# EAGLE design batteryholder2S4P (EAGLE 9.5.0)
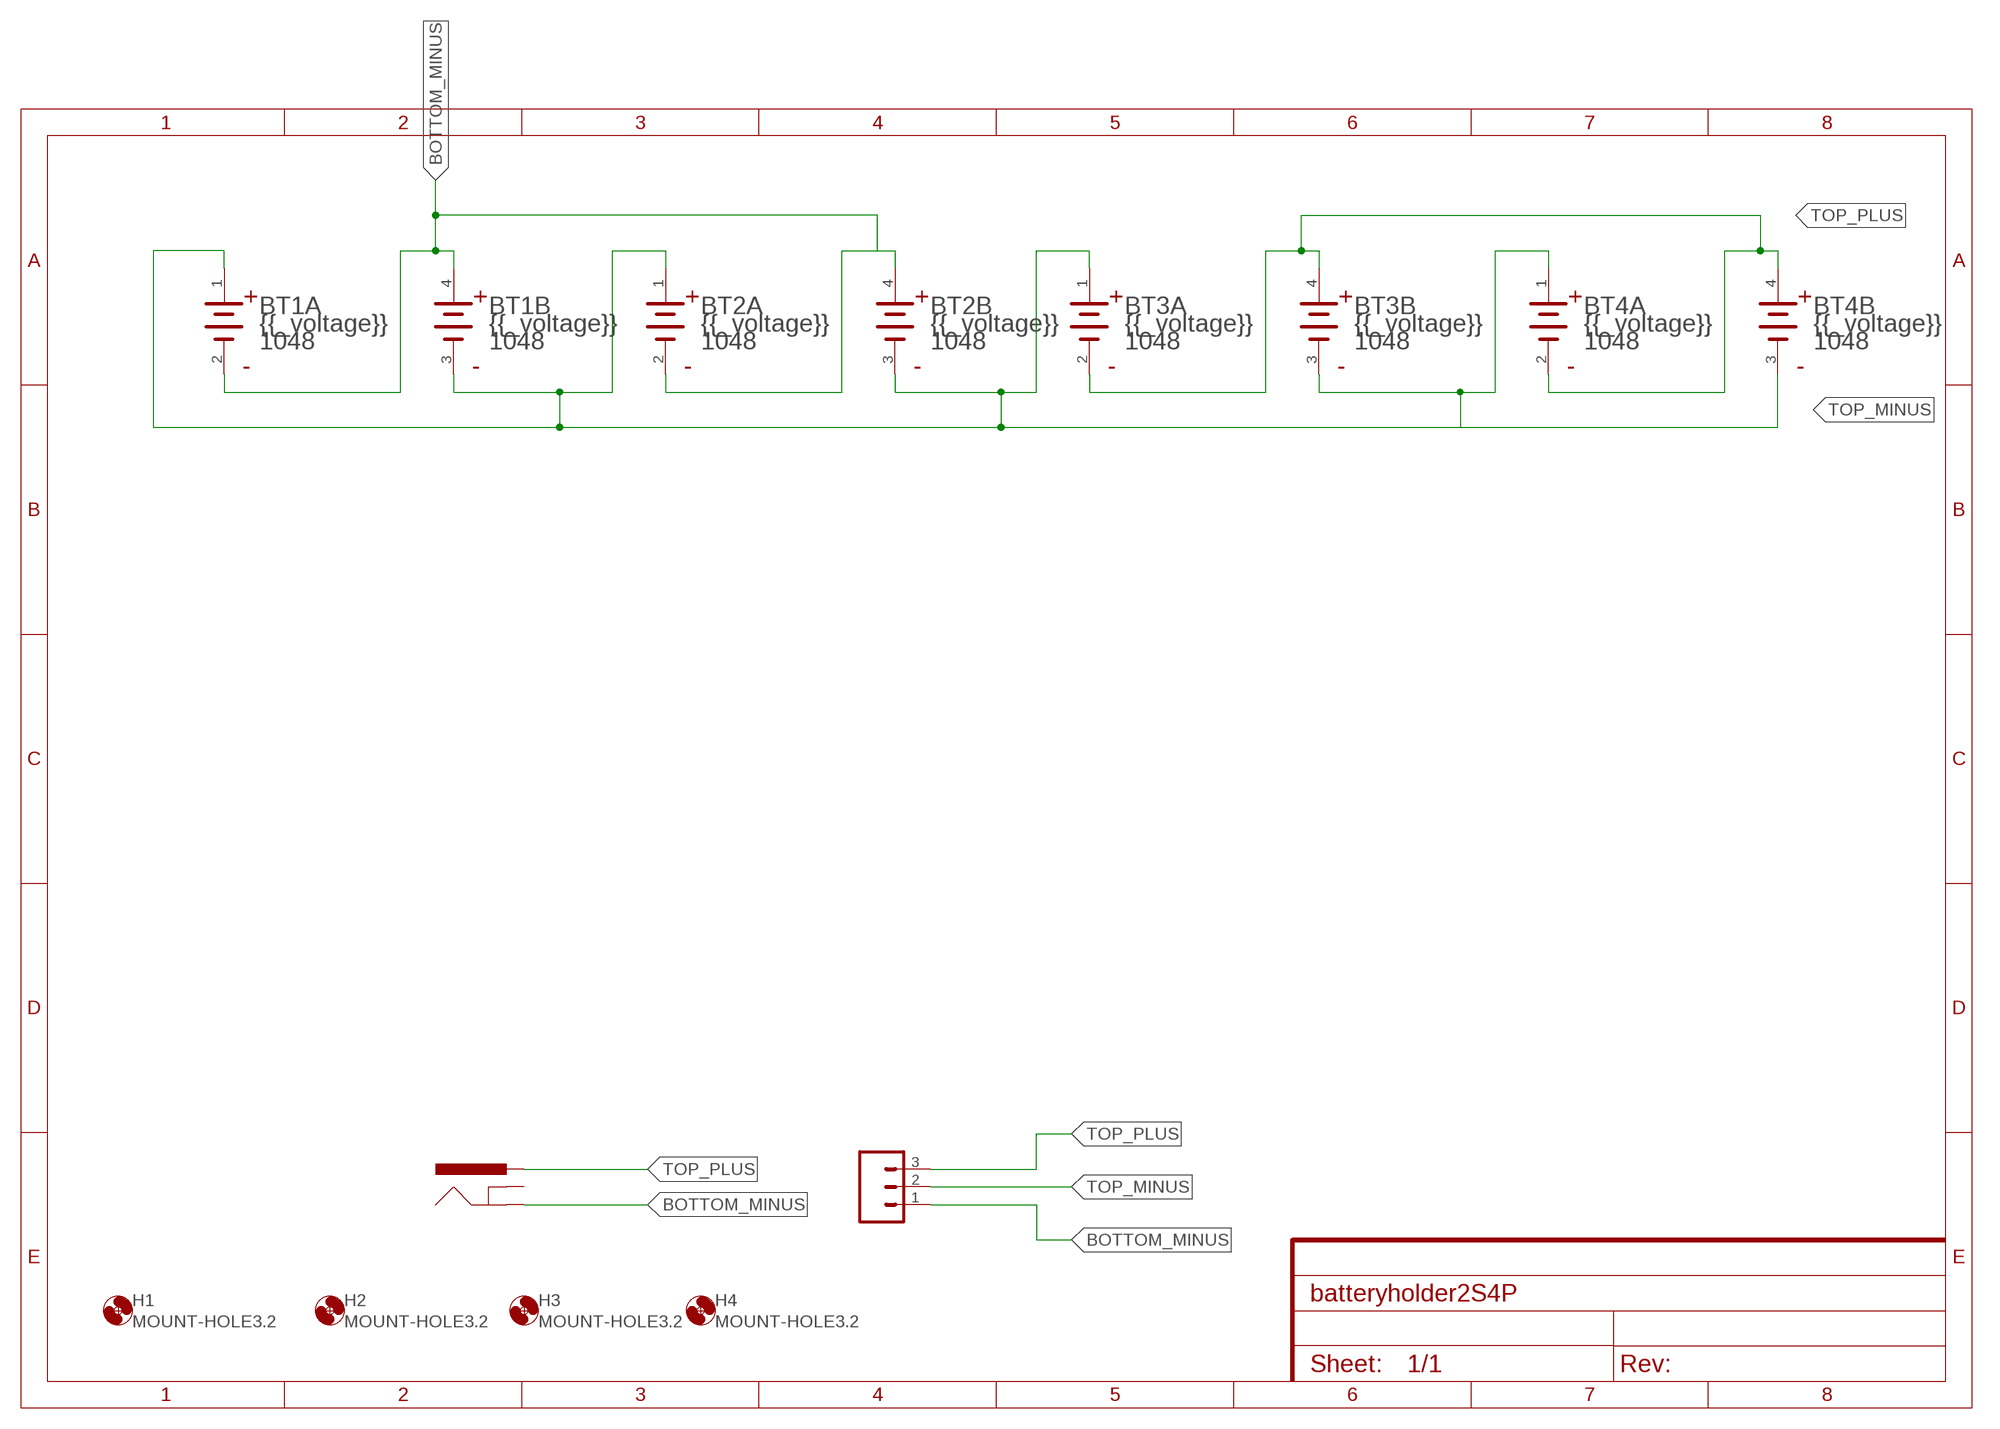
[diagram p0: schematic, sheet 1]

## Parts
BT1  KEYSTONE_1048KEYSTONE_1048_0_0  [KEYSTONE_1048_0]
BT2  KEYSTONE_1048KEYSTONE_1048_0_0  [KEYSTONE_1048_0]
BT3  KEYSTONE_1048KEYSTONE_1048_0_0  [KEYSTONE_1048_0]
BT4  KEYSTONE_1048KEYSTONE_1048_0_0  [KEYSTONE_1048_0]
H1  MOUNT-HOLE3.2  [3,2]
H2  MOUNT-HOLE3.2  [3,2]
H3  MOUNT-HOLE3.2  [3,2]
H4  MOUNT-HOLE3.2  [3,2]
J1  CONN_03-SCREW-5MM  [SCREWTERMINAL-5MM-3]
J3  POWER_JACKPTH_BREAD  [POWER_JACK_PTH_BREAD]

## Nets
BOTTOM_MINUS: BT1.2(A:1_CATHODE) BT1.4(B:2_ANODE) BT2.2(A:1_CATHODE) BT2.4(B:2_ANODE) J1.1 J3.GND
TOP_MINUS: BT1.1(A:1_ANODE) BT1.3(B:2_CATHODE) BT2.1(A:1_ANODE) BT2.3(B:2_CATHODE) BT3.1(A:1_ANODE) BT3.3(B:2_CATHODE) BT4.1(A:1_ANODE) BT4.3(B:2_CATHODE) J1.2
TOP_PLUS: BT3.2(A:1_CATHODE) BT3.4(B:2_ANODE) BT4.2(A:1_CATHODE) BT4.4(B:2_ANODE) J1.3 J3.PWR
Unconnected: J3.GNDBREAK

## Library data of the parts
BT1-BT4 = Keystone - 1048:KEYSTONE_1048: SMT Holder for Dual 18650 Batteries; CENTROID_NOT_SPECIFIED: No; CONN_ORIENTATION: Horizontal; CONTACT_MATERIAL: Gold,Nickel; DATASHEET: https://www.keyelco.com/userAssets/file/M65p27.pdf; DEVICE_CLASS_L1: Connectors; DEVICE_CLASS_L2: unset; DEVICE_CLASS_L3: unset; DIGIKEY_DESCRIPTION: BATT HOLDER 18650 2 CELL SMD TAB; DIGIKEY_PART_NUMBER: 36-1048-ND; FOOTPRINT_URL: https://www.keyelco.com/product-pdf.cfm?p=920; HEIGHT: 0.595inch; LEAD_FREE: yes; MF: Keystone; MFG_PACKAGE_IDENT: 1048; MFG_PACKAGE_IDENT_DATE: 0; MFG_PACKAGE_IDENT_REV: 0; MOUSER_DESCRIPTION: Battery holder SMD Dimensions L x W x H: 86 x 39.78 x 14.86 mm Suitable for: 2 x 18650; MOUSER_PART_NUMBER: 534-1048; MPN: 1048; NUMBER_OF_CONTACTS: 2; PACKAGE: SMT_BTTHLDR_18650_DUAL; PREFIX: BT; ROHS: yes; TEMPERATURE_RANGE_HIGH: +145°C; TEMPERATURE_RANGE_LOW: -50°C; VERIFICATION_VERSION: 0.0.0.1
H1-H4 = holes:MOUNT-HOLE: MOUNTING HOLE with drill center marker
J1 = SparkFun-Connectors:CONN_03: Multi connection point. Often used as Generic Header-pin footprint for 0.1 inch spaced/style header connections On any of the 0.1 inch spaced packages, you can populate with these: Break Away Headers - Straight <https://www.sparkfun.com/products/116> (PRT-00116) Break Away Male Headers - Right Angle <https://www.sparkfun.com/products/553> (PRT-00553) Female Headers <https://www.sparkfun.com/products/115> (PRT-00115) Break Away Headers - Machine Pin <https://www.sparkfun.com/products/117> (PRT-00117) Break Away Female Headers - Swiss Machine Pin <https://www.sparkfun.com/products/743> (PRT-00743) Stackable Header - 3 Pin (Female, 0.1") <https://www.sparkfun.com/products/13875> (PRT-13875) For SCREWTERMINALS and SPRING TERMINALS visit here: Screw Terimnals on SparkFun.com <https://www.sparkfun.com/search/results?term=Screw+Terminals> (5mm/3.5mm/2.54mm spacing) This device is also useful as a general connection point to wire up your design to another part of your project. Our various solder wires solder well into these plated through hole pads. Hook-Up Wire - Assortment (Stranded, 22 AWG) <https://www.sparkfun.com/products/11375> (PRT-11375) Hook-Up Wire - Assortment (Solid Core, 22 AWG) <https://www.sparkfun.com/products/11367> (PRT-11367) View the entire wire category on our website here <https://www.sparkfun.com/categories/141> Special notes: Molex polarized connector foot print use with SKU : PRT-08232 with associated crimp pins and housings.; PROD_ID: CONN-10134; SF_SKU: PRT-08433
J3 = SparkFun-Connectors:POWER_JACK: Power Jack Connector This is the standard 5.5mm barrel jack for power. The PTH is the most common, proven, reliable, footprint. The Slot footprint only works if the mill layer is transmitted to the PCB fab house so be warned. Here are the connectors we sell at SparkFun: DC Barrel Power Jack/Connector <https://www.sparkfun.com/products/119> (PRT-00119) DC Barrel Power Jack/Connector (SMD) <https://www.sparkfun.com/products/12748> (PRT-12748) DC Barrel Jack Adapter - Breadboard Compatible <https://www.sparkfun.com/products/10811> (PRT-10811) It is used on this SparkFun product (and many, many others): SparkFun RedBoard - Programmed with Arduino <https://www.sparkfun.com/products/12757> (DEV-12757) Also, if you need a mating power supply or connector, please check these out: Wall Adapter Power Supply - 9VDC 650mA <https://www.sparkfun.com/products/298> (TOL-00298) DC Barrel Jack Adapter - Male <https://www.sparkfun.com/products/10287> (PRT-10287); PROD_ID: PRT-10811

## Board
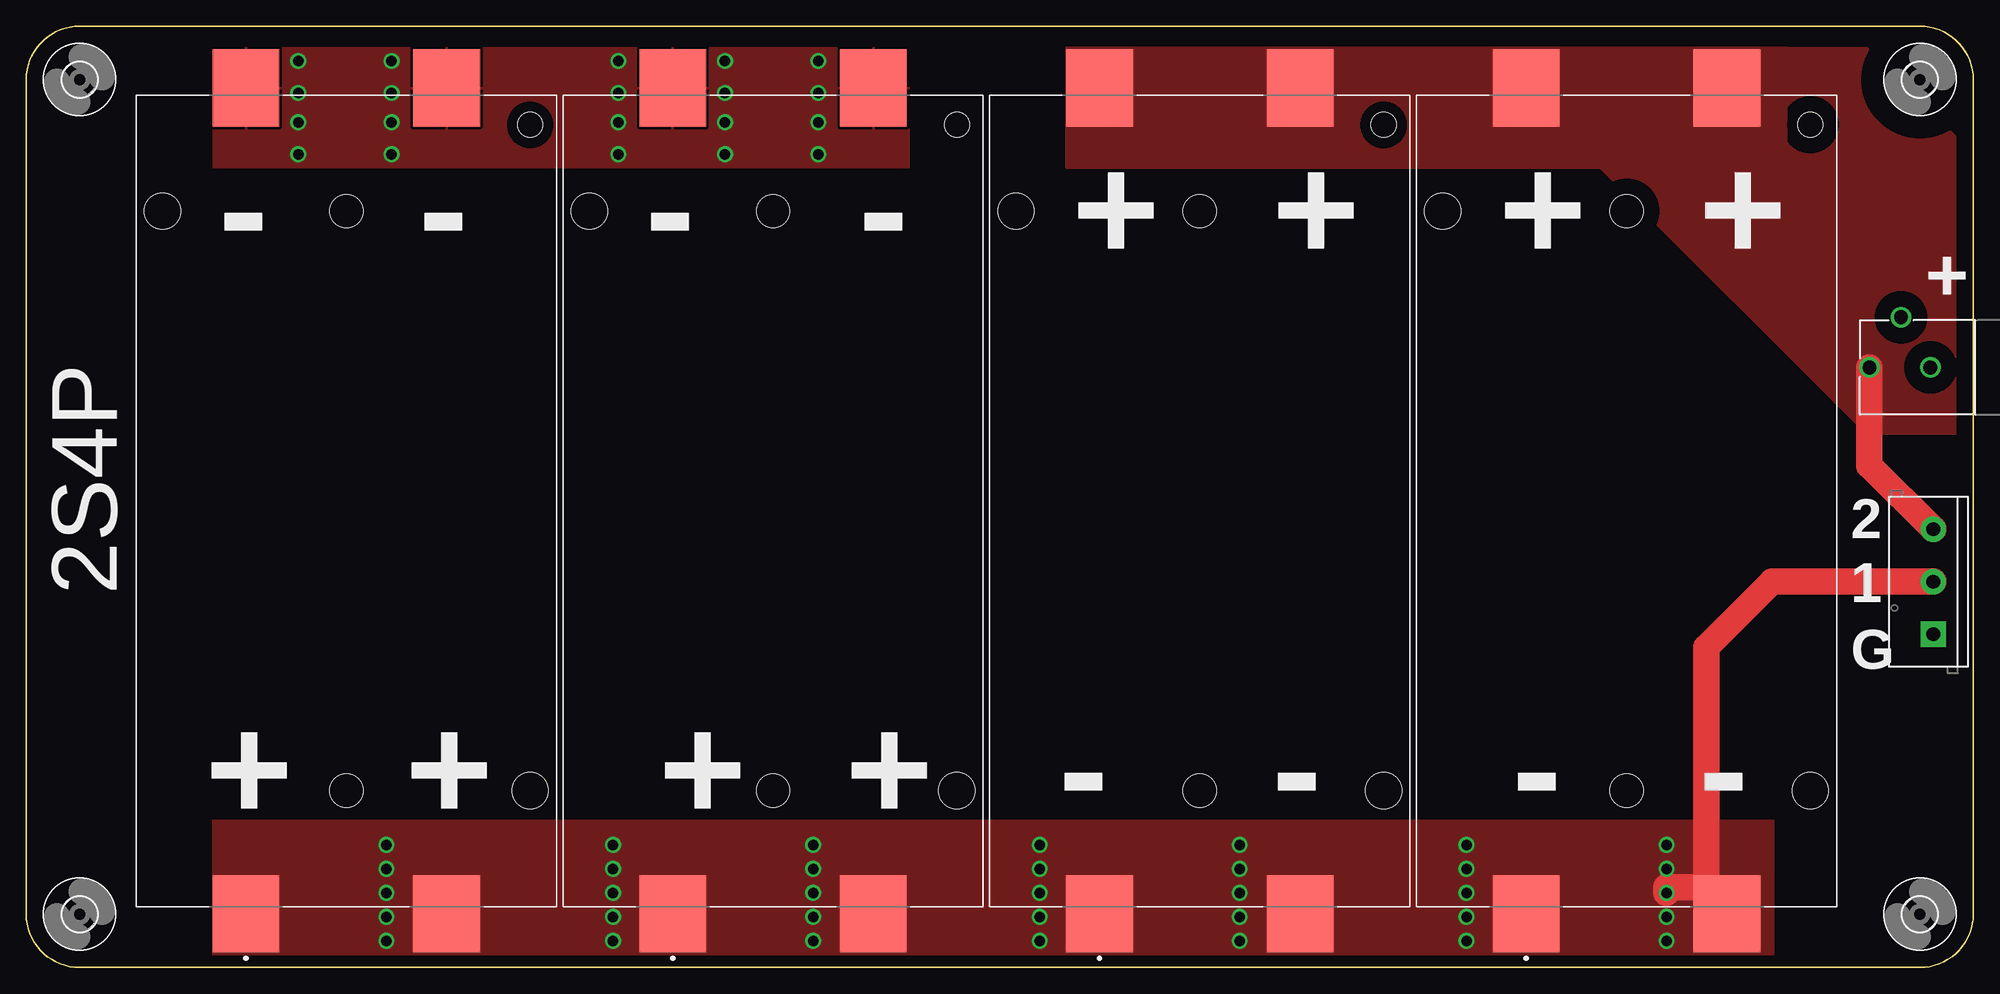
[diagram p1: board, top side]
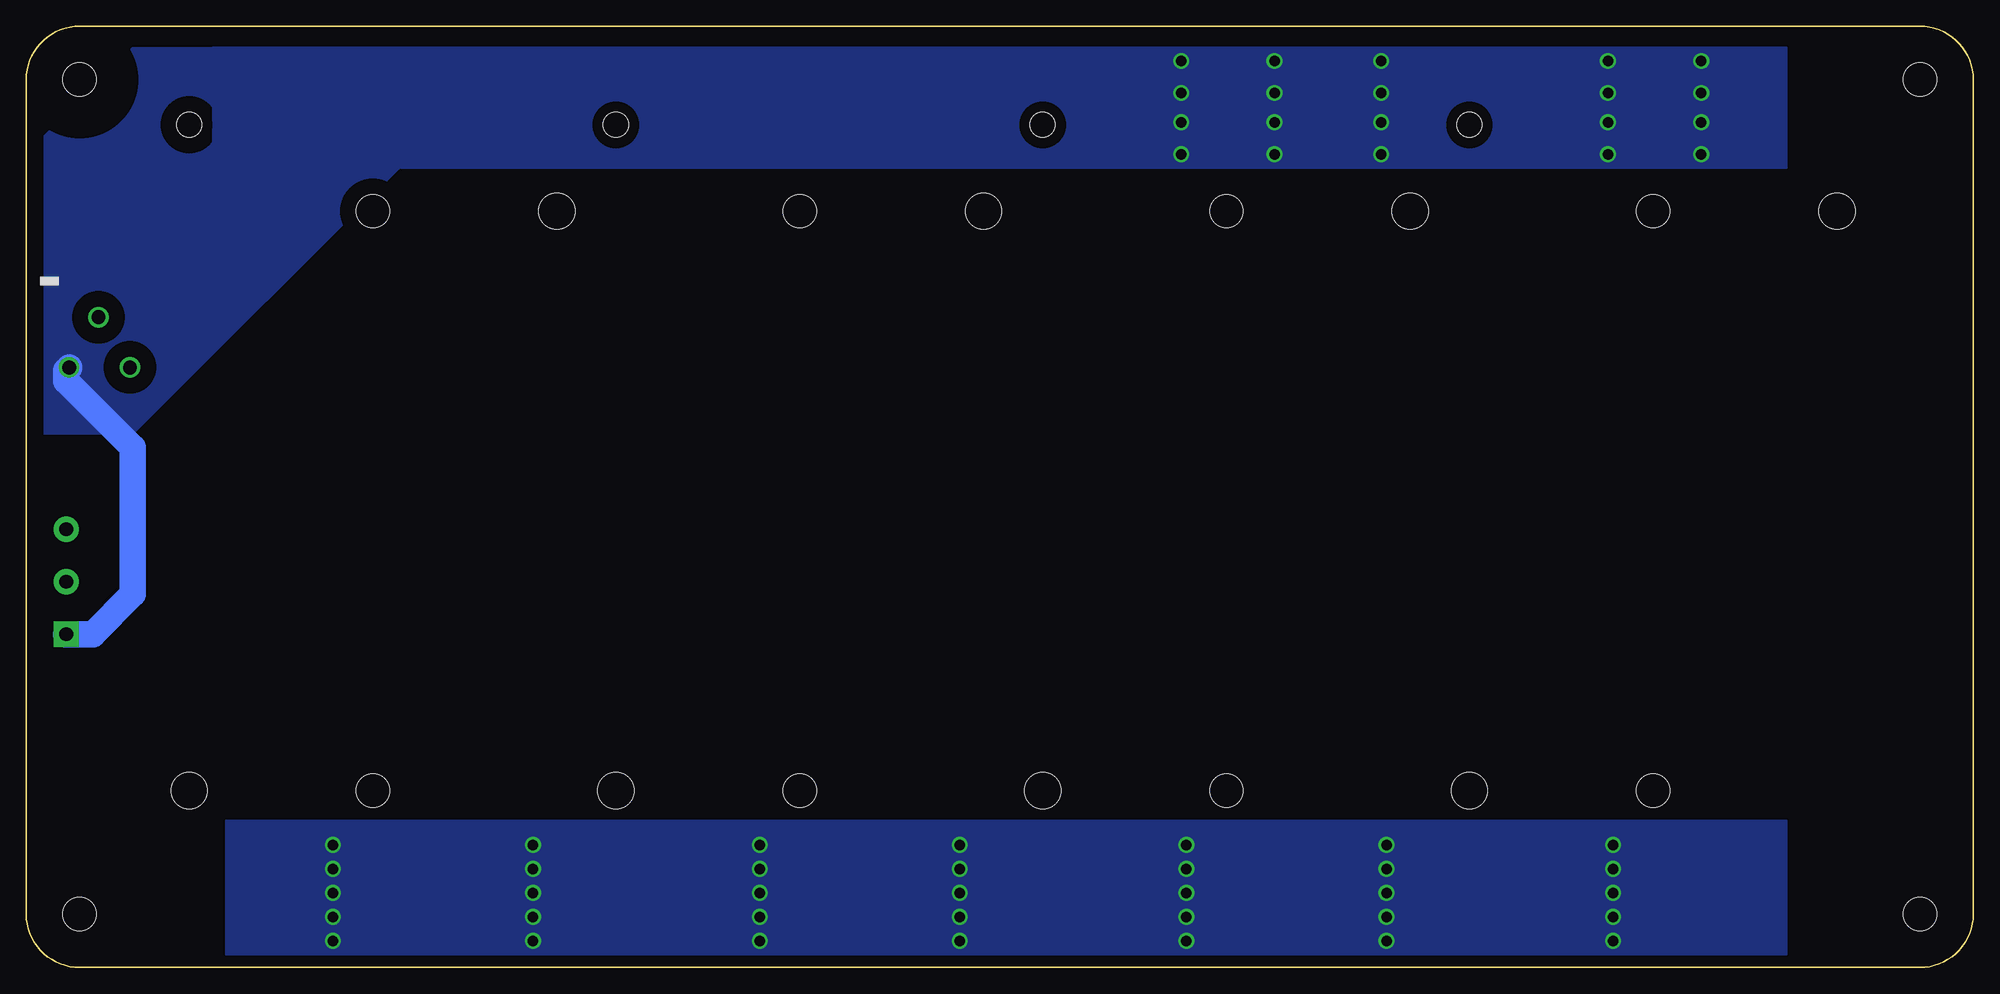
[diagram p2: board, bottom side, seen from below]

Size 185.42 x 89.66 mm. Coordinates in mm from the lower left corner, seen from the top.
Outline: 0,84.58 0,5.08 arc90 5.08,0 180.34,0 arc90 185.42,5.08 185.42,84.58 arc90 180.34,89.66 5.08,89.66 arc90 0,84.58
Copper layers (1*16): Top 0.035mm / dielectric 1.5mm / Bottom 0.035mm
Design rules "default": minimum track width 6mil, minimum drill 0.35mm, track to track 6mil, track to pad 6mil, pad to pad 6mil, via to via 6mil, smd to smd 6mil, copper to edge 40mil, drill to drill 6mil, minimum pad ring 10mil, minimum via ring 8mil, stop-mask expansion 4mil, vias tented up to drill 0mil, thermal gap 10mil

### Footprints (pad centres in the part's own frame; a part is rotated, then mirrored left to right if it is on the bottom)
KEYSTONE_1048_0 = smd 7.34 x 6.35: 1 -39.33,9.555; 2 39.33,9.555; 3 -39.33,-9.555; 4 39.33,-9.555 | hole 3.45: 27.6,17.505; -27.6,-17.505 | hole 2.39: 35.82,-17.505 | hole 3.17: 27.6,0; -27.6,0
3,2 = hole 3.2: 0,0
SCREWTERMINAL-5MM-3 = drill 1.3 pad 2.413 square: 1 0,0 | drill 1.3 pad 2.413: 2 5,0; 3 10,0
POWER_JACK_PTH_BREAD = drill 1.3: GND 0,7.9; GNDBREAK 4.8,10.7; PWR 0,13.7

### Placement (x,y rotation side)
BT1  30.48,44.45 90 top
BT2  71.12,44.45 90 top
BT3  111.76,44.45 90 top
BT4  152.4,44.45 90 top
H1  5.08,84.58 0 top
H2  5.08,5.08 0 top
H3  180.34,84.58 0 top
H4  180.34,5.08 0 top
J1  181.61,31.75 90 top
J3  189.23,57.15 90 top

### Tracks (layer width: path | path; a pad name or v marks a point on that pad's centre or on a via)
BOTTOM_MINUS  (via drill 1)
  Bottom 2.54: J3.GND 181.61,56.87 181.61,55.88 175.26,49.53 175.26,35.56 179.07,31.75 J1.1
  other vias: 75.44,86.36 75.44,83.31 75.44,80.52 75.44,77.47 25.91,86.36 25.91,83.31 25.91,80.52 25.91,77.47 34.8,86.36 34.8,83.31 34.8,80.52 34.8,77.47 56.39,86.36 56.39,83.31 56.39,80.52 56.39,77.47 66.55,86.36 66.55,83.31 66.55,80.52 66.55,77.47
  pour Bottom (no thermals): 17.78,87.63 17.78,76.2 167.64,76.2 167.64,87.63
  pour Bottom (isolate 1.524): 149.86,87.63 149.86,76.2 175.26,50.8 184.15,50.8 184.15,78.74 175.26,87.63
  pour Top: 17.78,76.2 84.07,76.2 84.07,87.63 17.78,87.63
TOP_MINUS  (via drill 1)
  Top 2.54: J1.2 166.29,36.75 160.02,30.48 160.02,7.62 156.21,7.62 v156.21,7.11
  other vias: 156.21,9.4 156.21,4.83 156.21,2.54 156.21,11.68 137.16,9.4 137.16,7.11 137.16,4.83 137.16,2.54 137.16,11.68 115.57,9.4 115.57,7.11 115.57,4.83 115.57,2.54 115.57,11.68 96.52,9.4 96.52,7.11 96.52,4.83 96.52,2.54 96.52,11.68 74.93,9.4 74.93,7.11 74.93,4.83 74.93,2.54 74.93,11.68 55.88,9.4 55.88,7.11 55.88,4.83 55.88,2.54 55.88,11.68 34.29,9.4 34.29,7.11 34.29,4.83 34.29,2.54 34.29,11.68
  pour Top (no thermals): 17.78,1.27 17.78,13.97 166.37,13.97 166.37,1.27
  pour Bottom (no thermals): 17.78,1.27 17.78,13.97 166.37,13.97 166.37,1.27
TOP_PLUS
  Top 2.54: J1.3 175.53,47.83 J3.PWR
  pour Top (no thermals): 99.06,87.63 99.06,76.2 167.64,76.2 167.64,87.63
  pour Top (isolate 1.524): 149.86,87.63 149.86,76.2 175.26,50.8 184.15,50.8 184.15,78.74 175.26,87.63

### Text on the board
tPlace: - | - | - | - | + | + | + | + | + | 2 | 2S4P | 1 | G | + | + | + | + | - | - | - | -
bPlace: -